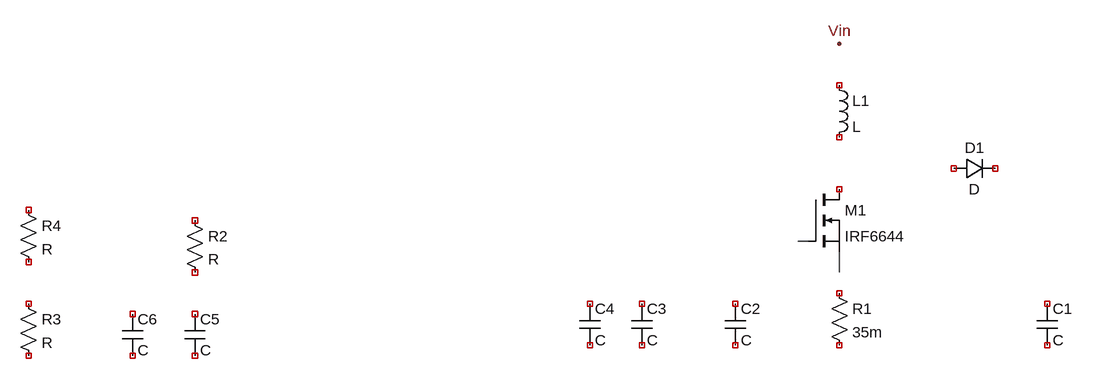
[diagram p0: schematic Boost_controller.asc]
Boost_controller.asc, the LTspice schematic file:
Version 4
SHEET 1 968 680
WIRE 560 128 544 128
WIRE 608 176 608 144
FLAG 608 -176 Vin
SYMBOL nmos 560 48 R0
SYMATTR InstName M1
SYMATTR Value IRF6644
SYMBOL res 592 192 R0
SYMATTR InstName R1
SYMATTR Value 35m
SYMBOL ind 592 -128 R0
SYMATTR InstName L1
SYMBOL diode 784 32 R270
WINDOW 0 32 32 VTop 2
WINDOW 3 0 32 VBottom 2
SYMATTR InstName D1
SYMBOL cap 912 224 R0
SYMATTR InstName C1
SYMBOL cap 432 224 R0
SYMATTR InstName C2
SYMBOL cap 288 224 R0
SYMATTR InstName C3
SYMBOL cap 208 224 R0
SYMATTR InstName C4
SYMBOL cap -400 240 R0
SYMATTR InstName C5
SYMBOL cap -496 240 R0
SYMATTR InstName C6
SYMBOL res -400 80 R0
SYMATTR InstName R2
SYMBOL res -656 208 R0
SYMATTR InstName R3
SYMBOL res -656 64 R0
SYMATTR InstName R4

The netlist it stands for:
* Boost_controller.asc
M1 NC_01 N001 N002 N002 IRF6644
R1 NC_02 NC_03 35m
L1 NC_04 NC_05 L
D1 NC_06 NC_07 D
C1 NC_08 NC_09 C
C2 NC_10 NC_11 C
C3 NC_12 NC_13 C
C4 NC_14 NC_15 C
C5 NC_16 NC_17 C
C6 NC_18 NC_19 C
R2 NC_20 NC_21 R
R3 NC_22 NC_23 R
R4 NC_24 NC_25 R
.model D D
.lib standard.dio
.model NMOS NMOS
.model PMOS PMOS
.lib standard.mos
.backanno
.end